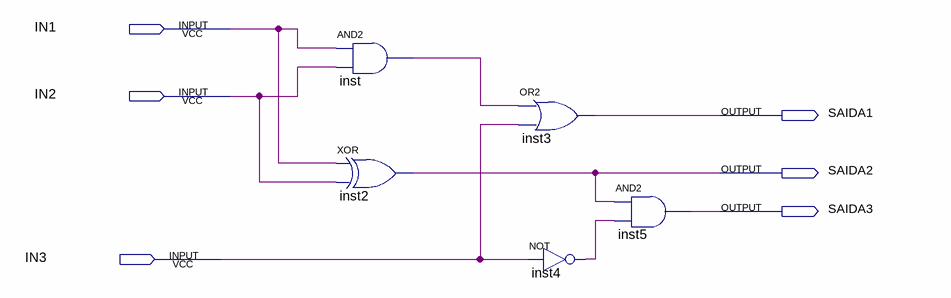
[diagram p0: schematic sheet]
// Quartus schematic Exemplo2.bdf as structural Verilog: 5 symbols, 6 pins
module Exemplo2 (
  input  IN1,
  input  IN2,
  input  IN3,
  output SAIDA1,
  output SAIDA2,
  output SAIDA3
);

  wire inst4_out, inst_out;

  and inst (inst_out, IN1, IN2);
  xor inst2 (SAIDA2, IN1, IN2);
  or inst3 (SAIDA1, inst_out, IN3);
  not inst4 (inst4_out, IN3);
  and inst5 (SAIDA3, SAIDA2, inst4_out);
endmodule
